# EAGLE schematic RoverMeter (EAGLE 6.4)
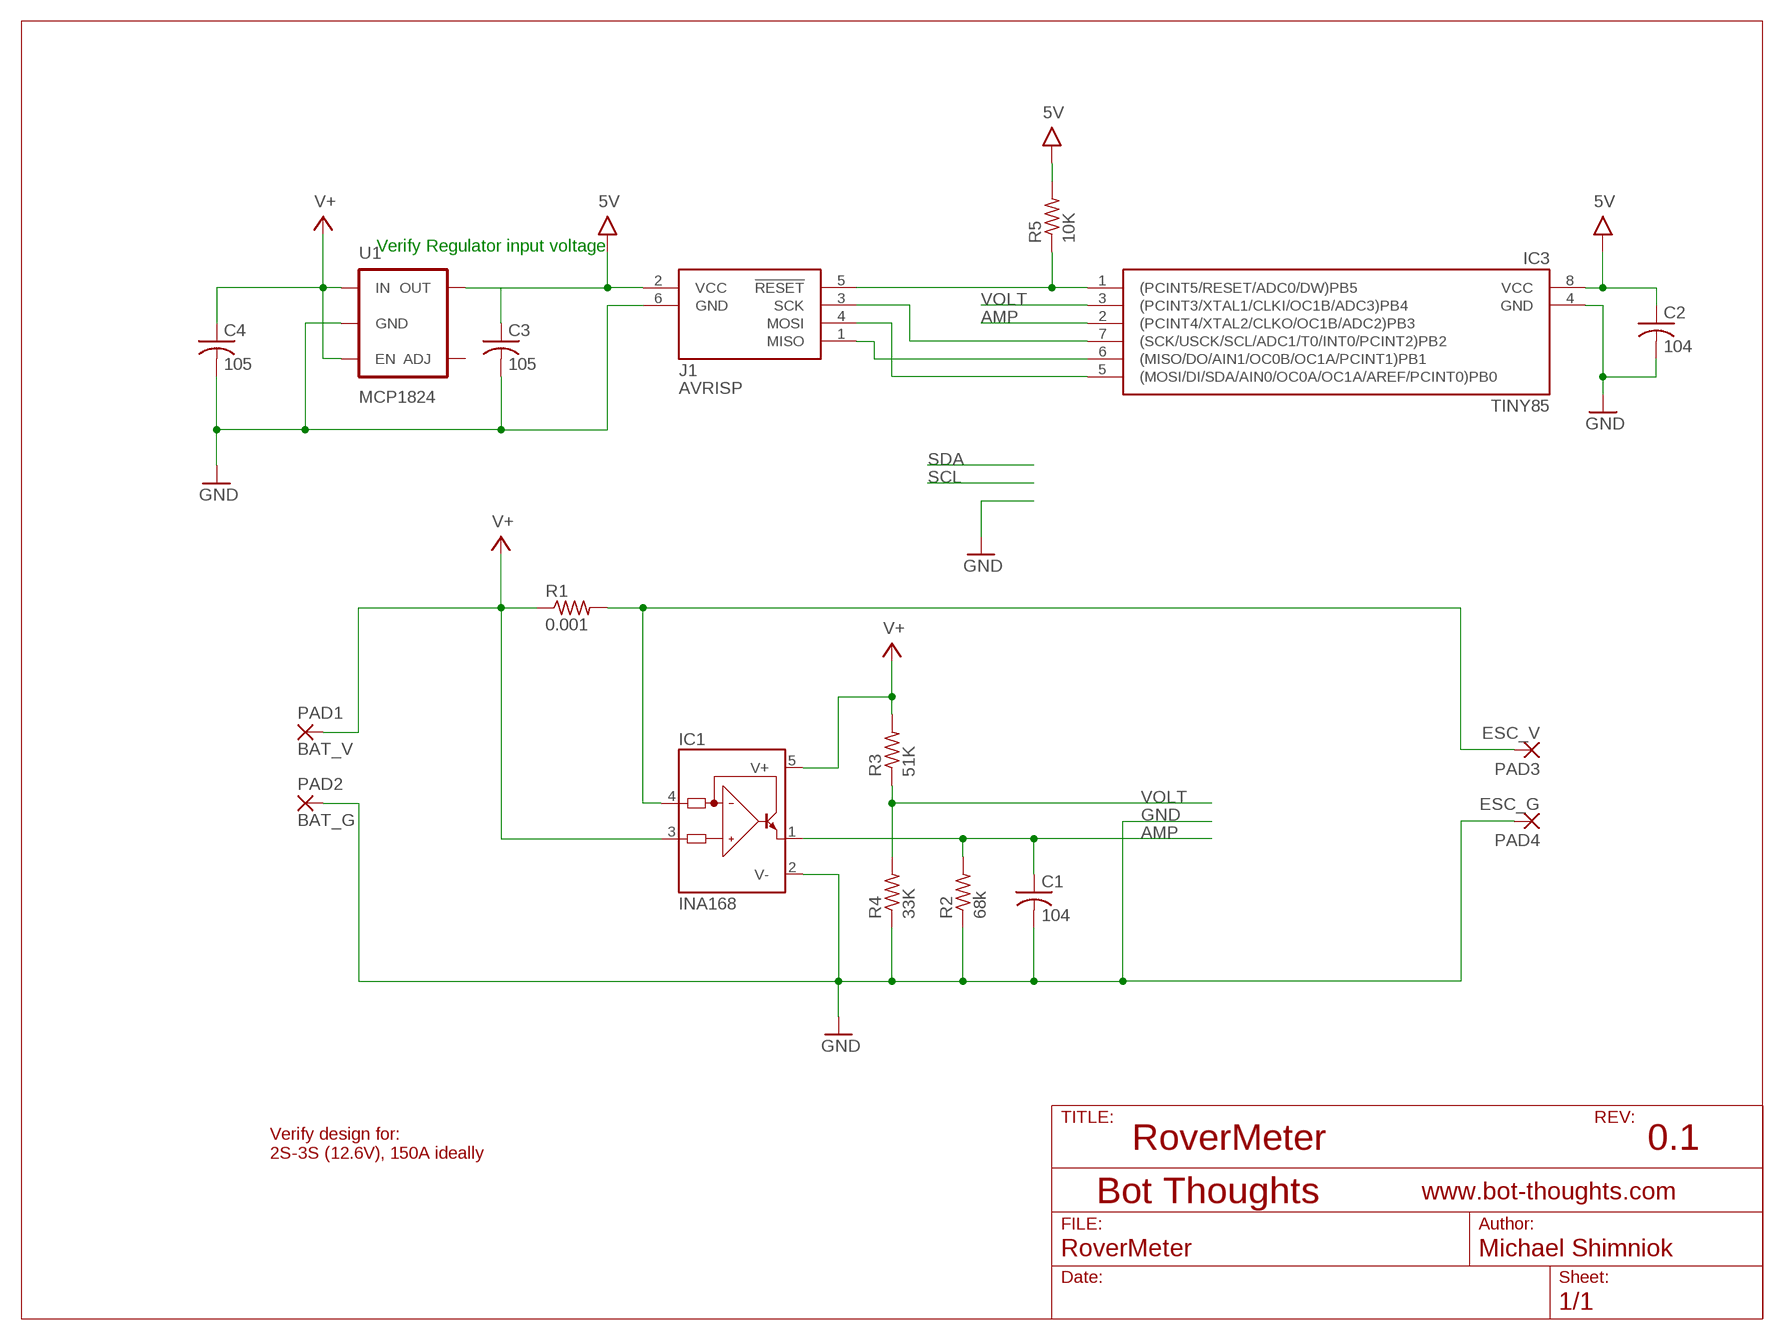
[diagram p0: schematic, sheet 1]

## Parts
C1  104  C-USC0603  [C0603]
C2  104  C-USC0603  [C0603]
C3  105  C-USC0603  [C0603]
C4  105  C-USC0603  [C0603]
IC1  INA168  [SOT23-5]
IC3  TINY85  TINY25/45/85-20SU  [SOIC8]
J1  AVRISP  AVRISP6  [CON6P2R]
PAD1  BAT_V  3,81/1,4  [3,81/1,4]
PAD2  BAT_G  3,81/1,4  [3,81/1,4]
PAD3  ESC_V  3,81/1,4  [3,81/1,4]
PAD4  ESC_G  3,81/1,4  [3,81/1,4]
R1  0.001  R-US_R4527  [R4527]
R2  68k  R-US_R0603  [R0603]
R3  51K  R-US_R0603  [R0603]
R4  33K  R-US_R0603  [R0603]
R5  10K  R-US_R0603  [R0603]
U1  MCP1824  [SOT23-5]

## Nets
5V: C2.1 C3.1 IC3.8(VCC) J1.2(VCC) R5.2 U1.5(OUT)
!RESET: IC3.1((PCINT5/RESET/ADC0/DW)PB5) J1.5(!RESET) R5.1
AMP: C1.1 IC1.1(OUT) IC3.2((PCINT4/XTAL2/CLKO/OC1B/ADC2)PB3) R2.2
GND: C1.2 C2.2 C3.2 C4.2 IC1.2(V-) IC3.4(GND) J1.6(GND) PAD2.1(P) PAD4.1(P) R2.1 R4.1 U1.2(GND)
MISO: IC3.6((MISO/DO/AIN1/OC0B/OC1A/PCINT1)PB1) J1.1(MISO)
N$4: IC1.4(IN-) PAD3.1(P) R1.2
SCL: IC3.7((SCK/USCK/SCL/ADC1/T0/INT0/PCINT2)PB2) J1.3(SCK)
SDA: IC3.5((MOSI/DI/SDA/AIN0/OC0A/OC1A/AREF/PCINT0)PB0) J1.4(MOSI)
V+: C4.1 IC1.3(IN+) IC1.5(V+) PAD1.1(P) R1.1 R3.2 U1.1(IN) U1.3(EN)
VOLT: IC3.3((PCINT3/XTAL1/CLKI/OC1B/ADC3)PB4) R3.1 R4.2
Unconnected: U1.4(ADJ)

## Notes on the sheet
- Verify Regulator input voltage
- RoverMeter | 0.1
- Verify design for:
  2S-3S (12.6V), 150A ideally

## Library data of the parts
C1 = resistor:C-US: CAPACITOR, American symbol
C2-C4 = rcl:C-US: CAPACITOR, American symbol
IC1 = burr-brown:INA168: High-Side Measurement Current Shunt Monitor; MF: TEXAS INSTRUMENTS; MPN: INA168NA/250; OC_FARNELL: 4375737; OC_NEWARK: 35C1744
IC3 = bt_avr:TINY25/45/85: Atmel AVR ATiny25,45,85 8-bit Microcontroller
J1 = bt_avr:AVRISP6: 6-pin dual-row connector for Atmel AVRISP programmer interface
PAD1-PAD4 = wirepad:3,81/1,4: THROUGH-HOLE PAD
R1 R2 = rcl:R-US_: RESISTOR, American symbol
R3-R5 = resistor:R-US_: RESISTOR, American symbol
U1 = bt_regulator:MCP1824: MCP1824 LDO voltage regulator The MCP1824/MCP1824S is a 300 mA Low Dropout (LDO) linear regulator that provides high current and low output voltages. The MCP1824 comes in a fixed or adjustable output voltage version, with an output voltage range of 0.8V to 5.0V. Datasheet.pdf <http://ww1.microchip.com/downloads/en/devicedoc/22070a.pdf>